# Altium schematic sheet MCU_Backup.SchDoc
size C
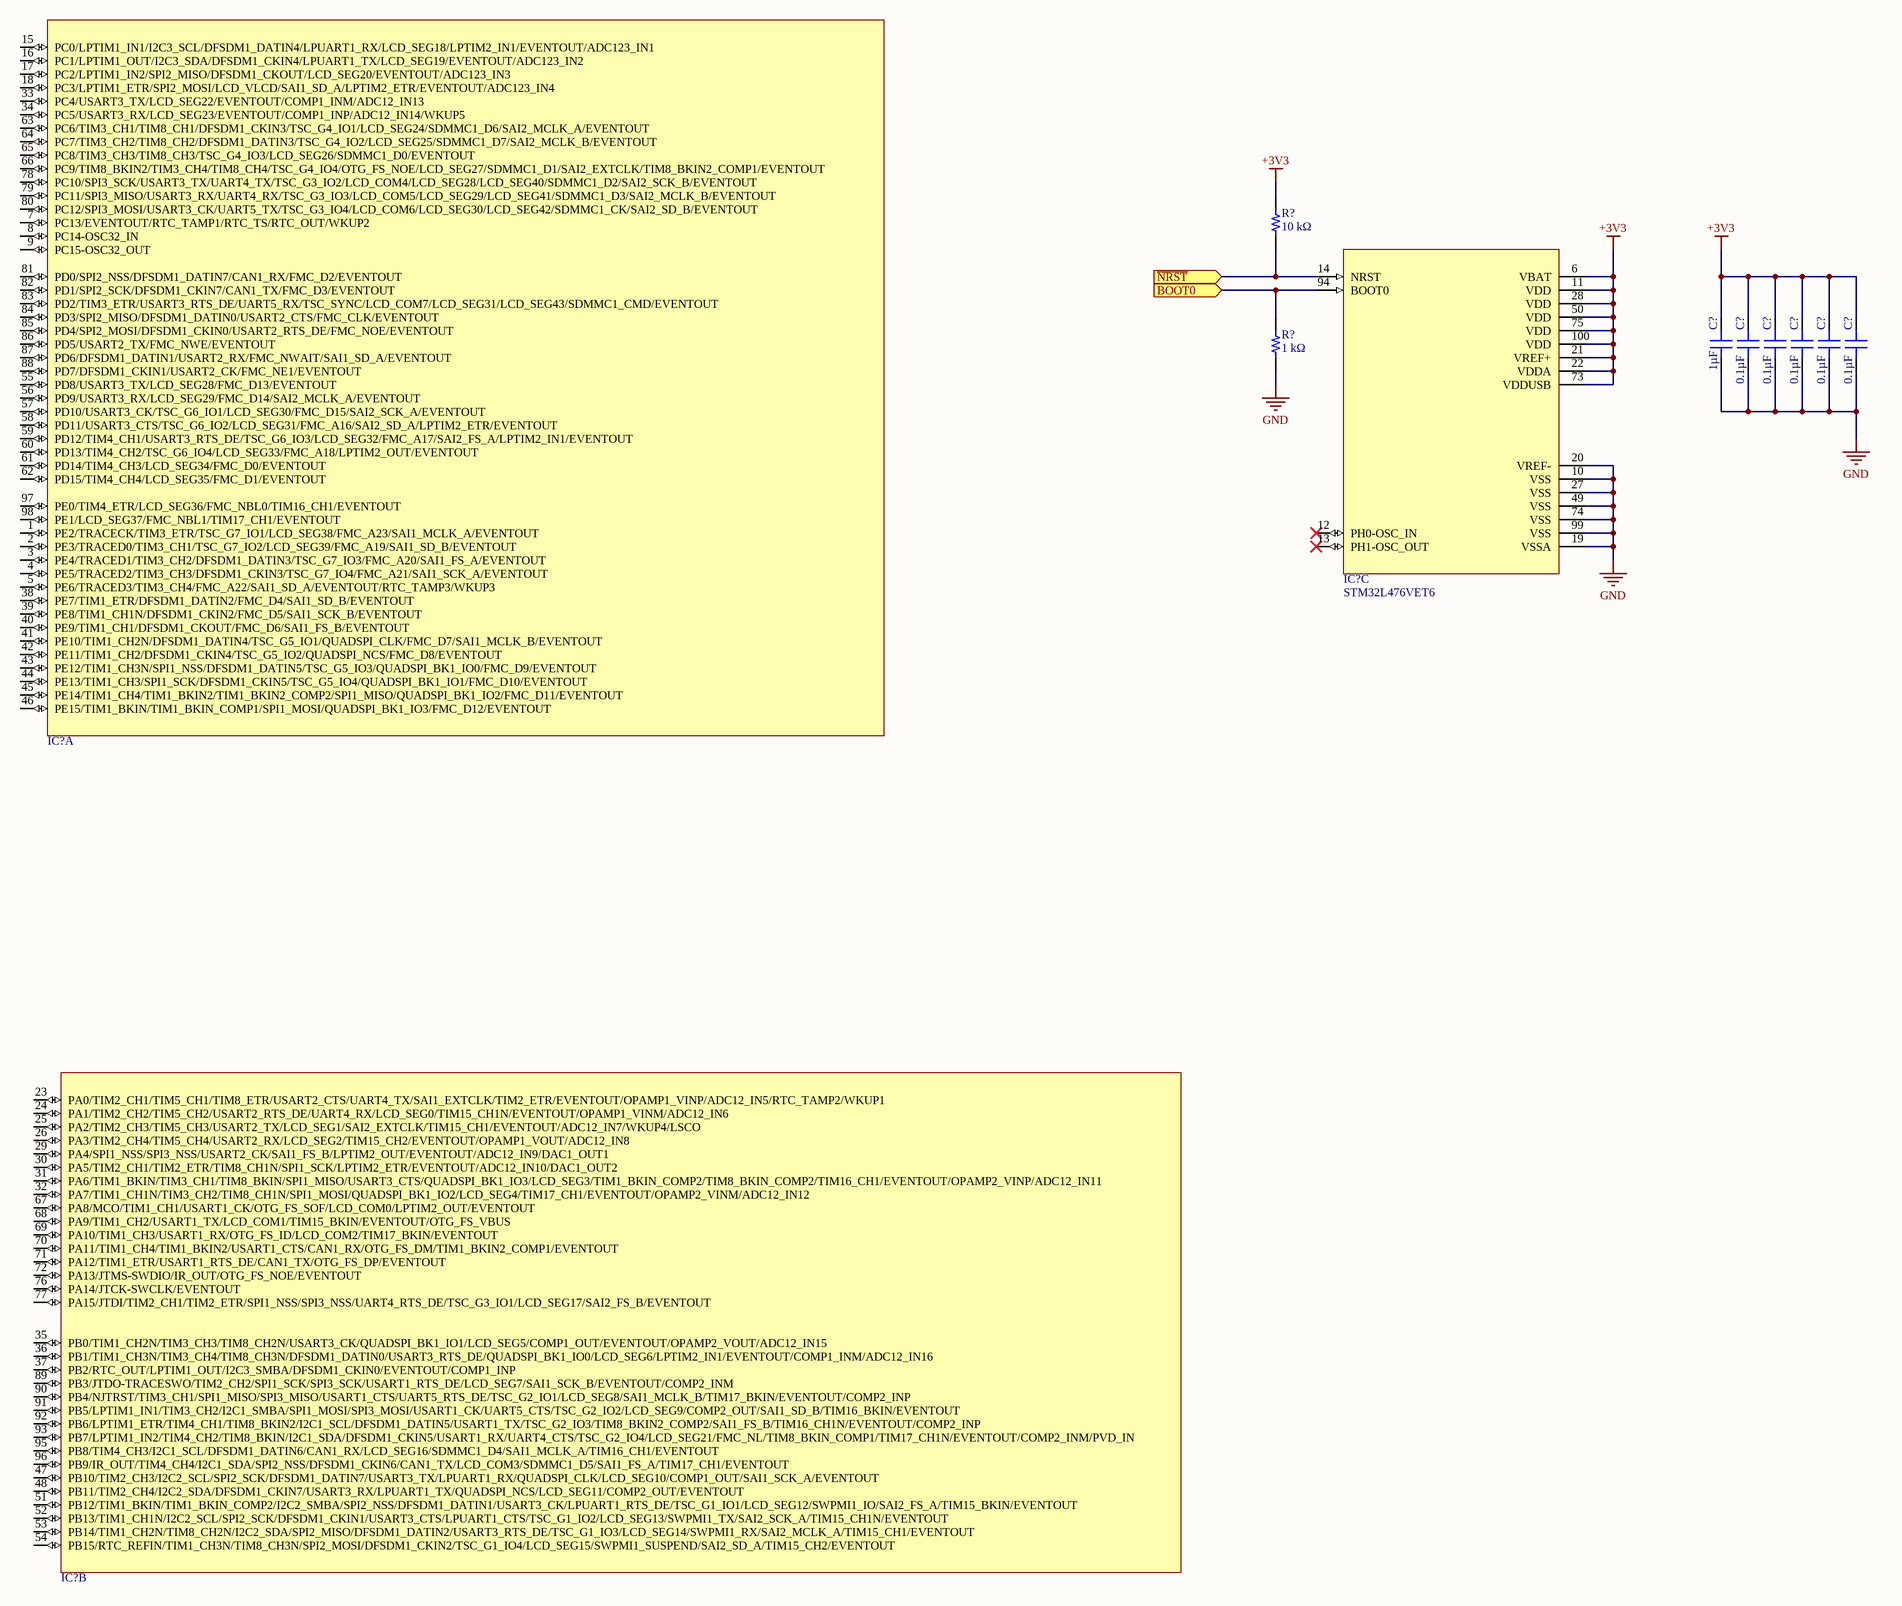
[diagram p0: MCU_Backup.SchDoc]

## Parts
(Parts that share a designator on the sheet are numbered #1, #2 ... from top to bottom, then left to right.)
C?#1  1µF  [CAP 0402_1005]
C?#2  0.1µF  [CAP 0402_1005]
C?#3  0.1µF  [CAP 0402_1005]
C?#4  0.1µF  [CAP 0402_1005]
C?#5  0.1µF  [CAP 0402_1005]
C?#6  0.1µF  [CAP 0402_1005]
IC?#1  STM32L476VET6  [ST LQFP-100 14x14MM]  (part C of 3)
IC?#2  STM32L476VET6  [ST LQFP-100 14x14MM]  (value not drawn)  (part A of 3)
IC?#3  STM32L476VET6  [ST LQFP-100 14x14MM]  (value not drawn)  (part B of 3)
R?#1  10 kΩ  [RES 0402_1005]
R?#2  1 kΩ  [RES 0402_1005]

## Ports
BOOT0 (in), ~{NRST} (in)

## Nets
+3V3: C?#1.1 C?#2.1 C?#3.1 C?#4.1 C?#5.1 C?#6.1 IC?#1.6(VBAT) IC?#1.11(VDD) IC?#1.21(VREF+) IC?#1.22(VDDA) IC?#1.28(VDD) IC?#1.50(VDD) IC?#1.73(VDDUSB) IC?#1.75(VDD) IC?#1.100(VDD) R?#1.1
GND: C?#1.2 C?#2.2 C?#3.2 C?#4.2 C?#5.2 C?#6.2 IC?#1.10(VSS) IC?#1.19(VSSA) IC?#1.20(VREF-) IC?#1.27(VSS) IC?#1.49(VSS) IC?#1.74(VSS) IC?#1.99(VSS) R?#2.2
~{NRST}: IC?#1.14(NRST) R?#1.2 ; port ~{NRST}
BOOT0: IC?#1.94(BOOT0) R?#2.1 ; port BOOT0

Not connected (* = marked no-connect by the designer): IC?#1 12(PH0-OSC_IN)* 13(PH1-OSC_OUT)*; IC?#2 1(PE2/TRACECK/TIM3_ETR/TSC_G7_IO1/LCD_SEG38/FMC_A23/SAI1_MCLK_A/EVENTOUT) 2(PE3/TRACED0/TIM3_CH1/TSC_G7_IO2/LCD_SEG39/FMC_A19/SAI1_SD_B/EVENTOUT) 3(PE4/TRACED1/TIM3_CH2/DFSDM1_DATIN3/TSC_G7_IO3/FMC_A20/SAI1_FS_A/EVENTOUT) 4(PE5/TRACED2/TIM3_CH3/DFSDM1_CKIN3/TSC_G7_IO4/FMC_A21/SAI1_SCK_A/EVENTOUT) 5(PE6/TRACED3/TIM3_CH4/FMC_A22/SAI1_SD_A/EVENTOUT/RTC_TAMP3/WKUP3) 7(PC13/EVENTOUT/RTC_TAMP1/RTC_TS/RTC_OUT/WKUP2) 8(PC14-OSC32_IN) 9(PC15-OSC32_OUT) 15(PC0/LPTIM1_IN1/I2C3_SCL/DFSDM1_DATIN4/LPUART1_RX/LCD_SEG18/LPTIM2_IN1/EVENTOUT/ADC123_IN1) 16(PC1/LPTIM1_OUT/I2C3_SDA/DFSDM1_CKIN4/LPUART1_TX/LCD_SEG19/EVENTOUT/ADC123_IN2) 17(PC2/LPTIM1_IN2/SPI2_MISO/DFSDM1_CKOUT/LCD_SEG20/EVENTOUT/ADC123_IN3) 18(PC3/LPTIM1_ETR/SPI2_MOSI/LCD_VLCD/SAI1_SD_A/LPTIM2_ETR/EVENTOUT/ADC123_IN4) 33(PC4/USART3_TX/LCD_SEG22/EVENTOUT/COMP1_INM/ADC12_IN13) 34(PC5/USART3_RX/LCD_SEG23/EVENTOUT/COMP1_INP/ADC12_IN14/WKUP5) 38(PE7/TIM1_ETR/DFSDM1_DATIN2/FMC_D4/SAI1_SD_B/EVENTOUT) 39(PE8/TIM1_CH1N/DFSDM1_CKIN2/FMC_D5/SAI1_SCK_B/EVENTOUT) 40(PE9/TIM1_CH1/DFSDM1_CKOUT/FMC_D6/SAI1_FS_B/EVENTOUT) 41(PE10/TIM1_CH2N/DFSDM1_DATIN4/TSC_G5_IO1/QUADSPI_CLK/FMC_D7/SAI1_MCLK_B/EVENTOUT) 42(PE11/TIM1_CH2/DFSDM1_CKIN4/TSC_G5_IO2/QUADSPI_NCS/FMC_D8/EVENTOUT) 43(PE12/TIM1_CH3N/SPI1_NSS/DFSDM1_DATIN5/TSC_G5_IO3/QUADSPI_BK1_IO0/FMC_D9/EVENTOUT) 44(PE13/TIM1_CH3/SPI1_SCK/DFSDM1_CKIN5/TSC_G5_IO4/QUADSPI_BK1_IO1/FMC_D10/EVENTOUT) 45(PE14/TIM1_CH4/TIM1_BKIN2/TIM1_BKIN2_COMP2/SPI1_MISO/QUADSPI_BK1_IO2/FMC_D11/EVENTOUT) 46(PE15/TIM1_BKIN/TIM1_BKIN_COMP1/SPI1_MOSI/QUADSPI_BK1_IO3/FMC_D12/EVENTOUT) 55(PD8/USART3_TX/LCD_SEG28/FMC_D13/EVENTOUT) 56(PD9/USART3_RX/LCD_SEG29/FMC_D14/SAI2_MCLK_A/EVENTOUT) 57(PD10/USART3_CK/TSC_G6_IO1/LCD_SEG30/FMC_D15/SAI2_SCK_A/EVENTOUT) 58(PD11/USART3_CTS/TSC_G6_IO2/LCD_SEG31/FMC_A16/SAI2_SD_A/LPTIM2_ETR/EVENTOUT) 59(PD12/TIM4_CH1/USART3_RTS_DE/TSC_G6_IO3/LCD_SEG32/FMC_A17/SAI2_FS_A/LPTIM2_IN1/EVENTOUT) 60(PD13/TIM4_CH2/TSC_G6_IO4/LCD_SEG33/FMC_A18/LPTIM2_OUT/EVENTOUT) 61(PD14/TIM4_CH3/LCD_SEG34/FMC_D0/EVENTOUT) 62(PD15/TIM4_CH4/LCD_SEG35/FMC_D1/EVENTOUT) 63(PC6/TIM3_CH1/TIM8_CH1/DFSDM1_CKIN3/TSC_G4_IO1/LCD_SEG24/SDMMC1_D6/SAI2_MCLK_A/EVENTOUT) 64(PC7/TIM3_CH2/TIM8_CH2/DFSDM1_DATIN3/TSC_G4_IO2/LCD_SEG25/SDMMC1_D7/SAI2_MCLK_B/EVENTOUT) 65(PC8/TIM3_CH3/TIM8_CH3/TSC_G4_IO3/LCD_SEG26/SDMMC1_D0/EVENTOUT) 66(PC9/TIM8_BKIN2/TIM3_CH4/TIM8_CH4/TSC_G4_IO4/OTG_FS_NOE/LCD_SEG27/SDMMC1_D1/SAI2_EXTCLK/TIM8_BKIN2_COMP1/EVENTOUT) 78(PC10/SPI3_SCK/USART3_TX/UART4_TX/TSC_G3_IO2/LCD_COM4/LCD_SEG28/LCD_SEG40/SDMMC1_D2/SAI2_SCK_B/EVENTOUT) 79(PC11/SPI3_MISO/USART3_RX/UART4_RX/TSC_G3_IO3/LCD_COM5/LCD_SEG29/LCD_SEG41/SDMMC1_D3/SAI2_MCLK_B/EVENTOUT) 80(PC12/SPI3_MOSI/USART3_CK/UART5_TX/TSC_G3_IO4/LCD_COM6/LCD_SEG30/LCD_SEG42/SDMMC1_CK/SAI2_SD_B/EVENTOUT) 81(PD0/SPI2_NSS/DFSDM1_DATIN7/CAN1_RX/FMC_D2/EVENTOUT) 82(PD1/SPI2_SCK/DFSDM1_CKIN7/CAN1_TX/FMC_D3/EVENTOUT) 83(PD2/TIM3_ETR/USART3_RTS_DE/UART5_RX/TSC_SYNC/LCD_COM7/LCD_SEG31/LCD_SEG43/SDMMC1_CMD/EVENTOUT) 84(PD3/SPI2_MISO/DFSDM1_DATIN0/USART2_CTS/FMC_CLK/EVENTOUT) 85(PD4/SPI2_MOSI/DFSDM1_CKIN0/USART2_RTS_DE/FMC_NOE/EVENTOUT) 86(PD5/USART2_TX/FMC_NWE/EVENTOUT) 87(PD6/DFSDM1_DATIN1/USART2_RX/FMC_NWAIT/SAI1_SD_A/EVENTOUT) 88(PD7/DFSDM1_CKIN1/USART2_CK/FMC_NE1/EVENTOUT) 97(PE0/TIM4_ETR/LCD_SEG36/FMC_NBL0/TIM16_CH1/EVENTOUT) 98(PE1/LCD_SEG37/FMC_NBL1/TIM17_CH1/EVENTOUT); IC?#3 23(PA0/TIM2_CH1/TIM5_CH1/TIM8_ETR/USART2_CTS/UART4_TX/SAI1_EXTCLK/TIM2_ETR/EVENTOUT/OPAMP1_VINP/ADC12_IN5/RTC_TAMP2/WKUP1) 24(PA1/TIM2_CH2/TIM5_CH2/USART2_RTS_DE/UART4_RX/LCD_SEG0/TIM15_CH1N/EVENTOUT/OPAMP1_VINM/ADC12_IN6) 25(PA2/TIM2_CH3/TIM5_CH3/USART2_TX/LCD_SEG1/SAI2_EXTCLK/TIM15_CH1/EVENTOUT/ADC12_IN7/WKUP4/LSCO) 26(PA3/TIM2_CH4/TIM5_CH4/USART2_RX/LCD_SEG2/TIM15_CH2/EVENTOUT/OPAMP1_VOUT/ADC12_IN8) 29(PA4/SPI1_NSS/SPI3_NSS/USART2_CK/SAI1_FS_B/LPTIM2_OUT/EVENTOUT/ADC12_IN9/DAC1_OUT1) 30(PA5/TIM2_CH1/TIM2_ETR/TIM8_CH1N/SPI1_SCK/LPTIM2_ETR/EVENTOUT/ADC12_IN10/DAC1_OUT2) 31(PA6/TIM1_BKIN/TIM3_CH1/TIM8_BKIN/SPI1_MISO/USART3_CTS/QUADSPI_BK1_IO3/LCD_SEG3/TIM1_BKIN_COMP2/TIM8_BKIN_COMP2/TIM16_CH1/EVENTOUT/OPAMP2_VINP/ADC12_IN11) 32(PA7/TIM1_CH1N/TIM3_CH2/TIM8_CH1N/SPI1_MOSI/QUADSPI_BK1_IO2/LCD_SEG4/TIM17_CH1/EVENTOUT/OPAMP2_VINM/ADC12_IN12) 35(PB0/TIM1_CH2N/TIM3_CH3/TIM8_CH2N/USART3_CK/QUADSPI_BK1_IO1/LCD_SEG5/COMP1_OUT/EVENTOUT/OPAMP2_VOUT/ADC12_IN15) 36(PB1/TIM1_CH3N/TIM3_CH4/TIM8_CH3N/DFSDM1_DATIN0/USART3_RTS_DE/QUADSPI_BK1_IO0/LCD_SEG6/LPTIM2_IN1/EVENTOUT/COMP1_INM/ADC12_IN16) 37(PB2/RTC_OUT/LPTIM1_OUT/I2C3_SMBA/DFSDM1_CKIN0/EVENTOUT/COMP1_INP) 47(PB10/TIM2_CH3/I2C2_SCL/SPI2_SCK/DFSDM1_DATIN7/USART3_TX/LPUART1_RX/QUADSPI_CLK/LCD_SEG10/COMP1_OUT/SAI1_SCK_A/EVENTOUT) 48(PB11/TIM2_CH4/I2C2_SDA/DFSDM1_CKIN7/USART3_RX/LPUART1_TX/QUADSPI_NCS/LCD_SEG11/COMP2_OUT/EVENTOUT) 51(PB12/TIM1_BKIN/TIM1_BKIN_COMP2/I2C2_SMBA/SPI2_NSS/DFSDM1_DATIN1/USART3_CK/LPUART1_RTS_DE/TSC_G1_IO1/LCD_SEG12/SWPMI1_IO/SAI2_FS_A/TIM15_BKIN/EVENTOUT) 52(PB13/TIM1_CH1N/I2C2_SCL/SPI2_SCK/DFSDM1_CKIN1/USART3_CTS/LPUART1_CTS/TSC_G1_IO2/LCD_SEG13/SWPMI1_TX/SAI2_SCK_A/TIM15_CH1N/EVENTOUT) 53(PB14/TIM1_CH2N/TIM8_CH2N/I2C2_SDA/SPI2_MISO/DFSDM1_DATIN2/USART3_RTS_DE/TSC_G1_IO3/LCD_SEG14/SWPMI1_RX/SAI2_MCLK_A/TIM15_CH1/EVENTOUT) 54(PB15/RTC_REFIN/TIM1_CH3N/TIM8_CH3N/SPI2_MOSI/DFSDM1_CKIN2/TSC_G1_IO4/LCD_SEG15/SWPMI1_SUSPEND/SAI2_SD_A/TIM15_CH2/EVENTOUT) 67(PA8/MCO/TIM1_CH1/USART1_CK/OTG_FS_SOF/LCD_COM0/LPTIM2_OUT/EVENTOUT) 68(PA9/TIM1_CH2/USART1_TX/LCD_COM1/TIM15_BKIN/EVENTOUT/OTG_FS_VBUS) 69(PA10/TIM1_CH3/USART1_RX/OTG_FS_ID/LCD_COM2/TIM17_BKIN/EVENTOUT) 70(PA11/TIM1_CH4/TIM1_BKIN2/USART1_CTS/CAN1_RX/OTG_FS_DM/TIM1_BKIN2_COMP1/EVENTOUT) 71(PA12/TIM1_ETR/USART1_RTS_DE/CAN1_TX/OTG_FS_DP/EVENTOUT) 72(PA13/JTMS-SWDIO/IR_OUT/OTG_FS_NOE/EVENTOUT) 76(PA14/JTCK-SWCLK/EVENTOUT) 77(PA15/JTDI/TIM2_CH1/TIM2_ETR/SPI1_NSS/SPI3_NSS/UART4_RTS_DE/TSC_G3_IO1/LCD_SEG17/SAI2_FS_B/EVENTOUT) 89(PB3/JTDO-TRACESWO/TIM2_CH2/SPI1_SCK/SPI3_SCK/USART1_RTS_DE/LCD_SEG7/SAI1_SCK_B/EVENTOUT/COMP2_INM) 90(PB4/NJTRST/TIM3_CH1/SPI1_MISO/SPI3_MISO/USART1_CTS/UART5_RTS_DE/TSC_G2_IO1/LCD_SEG8/SAI1_MCLK_B/TIM17_BKIN/EVENTOUT/COMP2_INP) 91(PB5/LPTIM1_IN1/TIM3_CH2/I2C1_SMBA/SPI1_MOSI/SPI3_MOSI/USART1_CK/UART5_CTS/TSC_G2_IO2/LCD_SEG9/COMP2_OUT/SAI1_SD_B/TIM16_BKIN/EVENTOUT) 92(PB6/LPTIM1_ETR/TIM4_CH1/TIM8_BKIN2/I2C1_SCL/DFSDM1_DATIN5/USART1_TX/TSC_G2_IO3/TIM8_BKIN2_COMP2/SAI1_FS_B/TIM16_CH1N/EVENTOUT/COMP2_INP) 93(PB7/LPTIM1_IN2/TIM4_CH2/TIM8_BKIN/I2C1_SDA/DFSDM1_CKIN5/USART1_RX/UART4_CTS/TSC_G2_IO4/LCD_SEG21/FMC_NL/TIM8_BKIN_COMP1/TIM17_CH1N/EVENTOUT/COMP2_INM/PVD_IN) 95(PB8/TIM4_CH3/I2C1_SCL/DFSDM1_DATIN6/CAN1_RX/LCD_SEG16/SDMMC1_D4/SAI1_MCLK_A/TIM16_CH1/EVENTOUT) 96(PB9/IR_OUT/TIM4_CH4/I2C1_SDA/SPI2_NSS/DFSDM1_CKIN6/CAN1_TX/LCD_COM3/SDMMC1_D5/SAI1_FS_A/TIM17_CH1/EVENTOUT)

## Library data of the parts
C?#1 = 0402ZD105KAT2A: CAP CER 1UF 10V X5R 0402; Manufacturer: AVX Corporation; Tolerance: ±10%; Part Number: 0402ZD105KAT2A; Applications: General Purpose; Capacitance: 1µF; ComponentLink1Description: Datasheet; ComponentLink1URL: http://datasheets.avx.com/cx5r.pdf; ComponentLink2Description: DigiKey Link; ComponentLink2URL: http://digikey.com/product-detail/en/avx-corporation/0402ZD105KAT2A/478-4596-1-ND/1645907; Device Package: 0402 (1005 Metric); LastUpdated: 2020-02-03 5:04:20 PM; Lifecycle Status: Active; Minimum Order: 1; Mounting Type: Surface Mount, MLCC; Operating Temperature: -55°C ~ 85°C; Package / Case: 0402 (1005 Metric); Packaging: TapeAndReel; Part Status: Active; Price: 0.03; Series: -; Size / Dimension: 0.039" L x 0.020" W (1.00mm x 0.50mm); Supplier 1: DigiKey; Supplier Part Number 1: 478-4596-1-ND; Temperature Coefficient: X5R; Thickness (Max): 0.022" (0.56mm); Value: 1µF; Voltage - Rated: 10V
C?#2-C?#6 = 04023C104JAT2A: CAP CER 0.1UF 25V X7R 0402; Manufacturer: AVX Corporation; Tolerance: ±5%; Part Number: 04023C104JAT2A; Applications: General Purpose; Capacitance: 0.1µF; ComponentLink1Description: Datasheet; ComponentLink1URL: http://datasheets.avx.com/X7RDielectric.pdf; ComponentLink2Description: DigiKey Link; ComponentLink2URL: http://digikey.com/product-detail/en/avx-corporation/04023C104JAT2A/478-10050-1-ND/6564273; Device Package: 0402 (1005 Metric); LastUpdated: 2020-02-03 5:03:51 PM; Lifecycle Status: Active; Minimum Order: 1; Mounting Type: Surface Mount, MLCC; Operating Temperature: -55°C ~ 125°C; Package / Case: 0402 (1005 Metric); Packaging: CutTape; Part Status: Active; Price: 0.14; Series: -; Size / Dimension: 0.039" L x 0.020" W (1.00mm x 0.50mm); Supplier 1: DigiKey; Supplier Part Number 1: 478-10050-1-ND; Temperature Coefficient: X7R; Thickness (Max): 0.022" (0.56mm); Value: 0.1µF; Voltage - Rated: 25V
IC?#1-IC?#3 = STM32L476VET6: IC MCU 32BIT 512KB FLASH 100LQFP; Manufacturer: STMicroelectronics; Connectivity: CANbus, EBI/EMI, I²C, IrDA, LINbus, MMC/SD, QSPI, SAI, SPI, SWPMI, UART/USART, USB OTG; Core Processor: ARM® Cortex®-M4; Core Size: 32-Bit; Data Converters: A/D 16x12b; D/A 2x12b; Number of I/O: 82; Oscillator Type: Internal; Peripherals: Brown-out Detect/Reset, DMA, LCD, PWM, WDT; Program Memory Size: 512KB (512K x 8); RAM Size: 128K x 8; Speed: 80MHz; Voltage - Supply (Vcc/Vdd): 1.71V ~ 3.6V; Part Number: STM32L476VET6; ComponentLink1Description: Datasheet; ComponentLink1URL: http://www.st.com/content/ccc/resource/technical/document/datasheet/c5/ed/2f/60/aa/79/42/0b/DM00108832.pdf/files/DM00108832.pdf/jcr:content/translations/en.DM00108832.pdf; ComponentLink2Description: Digikey Link; ComponentLink2URL: https://www.digikey.com/en/products/detail/stmicroelectronics/STM32L476VET6/5344354; Device Package: 100-LQFP; EEPROM Size: -; LastUpdated: 2020-11-08 8:46:29 PM; Lifecycle Status: 0; Minimum Order: 1; Mounting Type: Surface Mount; Operating Temperature: -40°C ~ 85°C (TA); Package / Case: 100-LQFP; Packaging: Tray; Part Status: Active; Price: 9.40; Program Memory Type: FLASH; Series: STM32L4; Supplier 1: Digikey; Supplier Part Number 1: 497-15878-ND; Supplier Device Package: 100-LQFP (14x14)
R?#1 = AC0402FR-0710KL: RES SMD 10K OHM 1% 1/16W 0402; Manufacturer: Yageo; Power (Watts): 0.063W, 1/16W; Temperature Coefficient: ±100ppm/°C; Value: 10 kOhms; Part Number: AC0402FR-0710KL; ComponentLink1Description: Datasheet; ComponentLink1URL: https://www.yageo.com/upload/media/product/productsearch/datasheet/rchip/PYu-AC_51_RoHS_L_7.pdf; ComponentLink2Description: DigiKey Link; ComponentLink2URL: http://digikey.com/product-detail/en/yageo/AC0402FR-0710KL/YAG3436CT-ND/6006285; Composition: Thick Film; Device Package: 0402 (1005 Metric); Features: Automotive AEC-Q200, Moisture Resistant; Height - Seated (Max): 0.015" (0.37mm); LastUpdated: 2020-02-19 6:28:05 AM; Lifecycle Status: Active; Minimum Order: 1; Number of Terminations: 2; Operating Temperature: -55°C ~ 155°C; Package / Case: 0402 (1005 Metric); Packaging: CutTape; Part Status: Active; Price: 0.10; Ratings: AEC-Q200; Resistance: 10 kΩ; Series: AC; Size / Dimension: 0.039" L x 0.020" W (1.00mm x 0.50mm); Supplier 1: DigiKey; Supplier Part Number 1: YAG3436CT-ND; Supplier Device Package: 0402; Tolerance: ±1%
R?#2 = AC0402FR-071KL: RES SMD 1K OHM 1% 1/16W 0402; Manufacturer: Yageo; Power (Watts): 0.063W, 1/16W; Temperature Coefficient: ±100ppm/°C; Value: 1 kOhms; Part Number: AC0402FR-071KL; ComponentLink1Description: Datasheet; ComponentLink1URL: https://www.yageo.com/upload/media/product/productsearch/datasheet/rchip/PYu-AC_51_RoHS_L_7.pdf; ComponentLink2Description: DigiKey Link; ComponentLink2URL: http://digikey.com/product-detail/en/yageo/AC0402FR-071KL/311-1KLBCT-ND/2828122; Composition: Thick Film; Device Package: 0402 (1005 Metric); Features: Automotive AEC-Q200, Moisture Resistant; Height - Seated (Max): 0.015" (0.37mm); LastUpdated: 2020-02-19 6:28:05 AM; Lifecycle Status: Active; Minimum Order: 1; Number of Terminations: 2; Operating Temperature: -55°C ~ 155°C; Package / Case: 0402 (1005 Metric); Packaging: CutTape; Part Status: Active; Price: 0.10; Ratings: AEC-Q200; Resistance: 1 kΩ; Series: AC; Size / Dimension: 0.039" L x 0.020" W (1.00mm x 0.50mm); Supplier 1: DigiKey; Supplier Part Number 1: 311-1KLBCT-ND; Supplier Device Package: 0402; Tolerance: ±1%